# Altium schematic sheet PolarityProtection.SchDoc
size A4; SheetNumber: 3; SheetTotal: 3
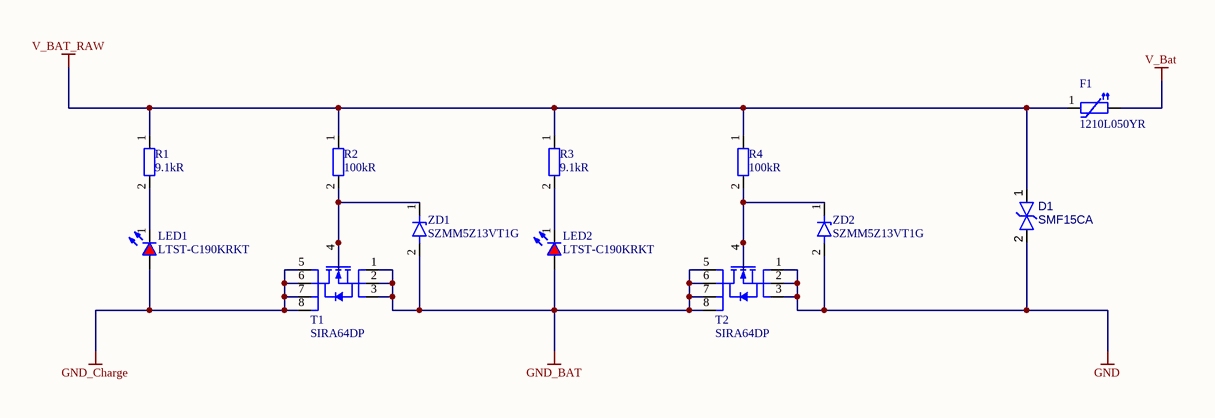
[diagram p0: PolarityProtection.SchDoc]

## Parts
D1  SMF15CA  [SODFL370X110-2L]
F1  1210L050YR  [FUSER3225X08L]
LED1  LTST-C190KRKT  [LEDSC160X80X80-2Lrd]
LED2  LTST-C190KRKT  [LEDSC160X80X80-2Lrd]
R1  9.1kR  [RESC1608X06L]
R2  100kR  [RESC1608X06L]
R3  9.1kR  [RESC1608X06L]
R4  100kR  [RESC1608X06L]
T1  SIRA64DP  [SON127P620X110-9T400X365L]
T2  SIRA64DP  [SON127P620X110-9T400X365L]
ZD1  SZMM5Z13VT1G  [SODFL160X70-2L]
ZD2  SZMM5Z13VT1G  [SODFL160X70-2L]

## Nets
GND: D1.2(A) T2.1(S) T2.2(S) T2.3(S) ZD2.2(Anode)
GND_BAT: LED2.2(A) T1.1(S) T1.2(S) T1.3(S) T2.5(D) T2.6(D) T2.7(D) T2.8(D) ZD1.2(Anode)
GND_Charge: LED1.2(A) T1.5(D) T1.6(D) T1.7(D) T1.8(D)
V_Bat: F1.2
V_BAT_RAW: D1.1(A) F1.1 R1.1 R2.1 R3.1 R4.1
NetLED1_1: LED1.1(K) R1.2
NetLED2_1: LED2.1(K) R3.2
NetR2_2: R2.2 T1.4(G) ZD1.1(Cathode)
NetR4_2: R4.2 T2.4(G) ZD2.1(Cathode)

## Library data of the parts
D1 = CMP-004-00062-15: TVS Diode, bidirectional, 15V, 8.2A, 200W, SOD-123FL-2; Connection: single; Case/Package: SOD-123FL-2; Peak Current: 8.2A; Rated Voltage: 15V; Peak Power: 200W; Size: 0; Mounting Technology: SMD; Direction: bidirectional
F1 = CMP-00093-10: Resettable Fuse, Ihold 500mA, Itrip 1A, 13.2V, 1210; Mounting Technology: SMD; Ihold: 500mA; Itrip: 1A; Voltage Rating: 13.2V; Case/Package: 1210
LED1 LED2 = CMP-007-00024-16: LED, Red, 20mA, 2.0V, 0603; Forward Voltage: 2V; Case/Package: 0603; Mounting Technology: SMD; Color: Red; Rated Current: 20mA; Size: L1.6B0.8H0.8
R1 R3 = CMP-009-00472-1: Res, 9.1kR, 1%, 0.1W, 0603; Power: 100mW; Voltage Rating: 75V; Value: 9.1k; Tolerance: 1%; Case Code (Metric): 1608; Mounting Technology: SMD; Case/Package: 0603; Type: Fixed
R2 R4 = CMP-009-00023-30: Res, 100kR, 1%, 0.1W, 0603; Voltage Rating: 50V; Power: 100mW; Value: 100k; Type: Fixed; Case/Package: 0603; Mounting Technology: SMD; Case Code (Metric): 1608; Tolerance: 1%
T1 T2 = CMP-013-00069-15: MOSFET N-Enh, 30V, 60A, 100Ap, 2.1mR, 27.8W, SO-8; Current peak: 100A; Resistance: 2.1m; Case/Package: PowerPAK-SO-8; Power: 27.8W; Voltage: 30V; Current: 60A; Type: MOSFET; Technology: N-enh; Mounting Technology: SMD
ZD1 ZD2 = CMP-004-00080-13: Zener Diode, 13.25V±0.85V, 5mA, 30R, 500mW, SOD-523-2; Voltage: 13.25V; Current: 100nA; Mounting Technology: SMD; Power: 500mW; Type: Zener; Case/Package: SOD-523-2